# Altium project eva01.PrjPcb (part 2 of 2)

## Sheet wifi.schdoc: DevelBoard EVA01 WiFi Module.
size A3; Author: Daniele Basile <asterix@develer.com>; Organization: Develer s.r.l.; Address1: via Mugellese 1/A; Address2: 50019 Campi Bisenzio; Address3: Firenze; Address4: ITALY; DocumentNumber: 6; Revision: B; SheetNumber: 6; SheetTotal: 6; Hw_rev: R2
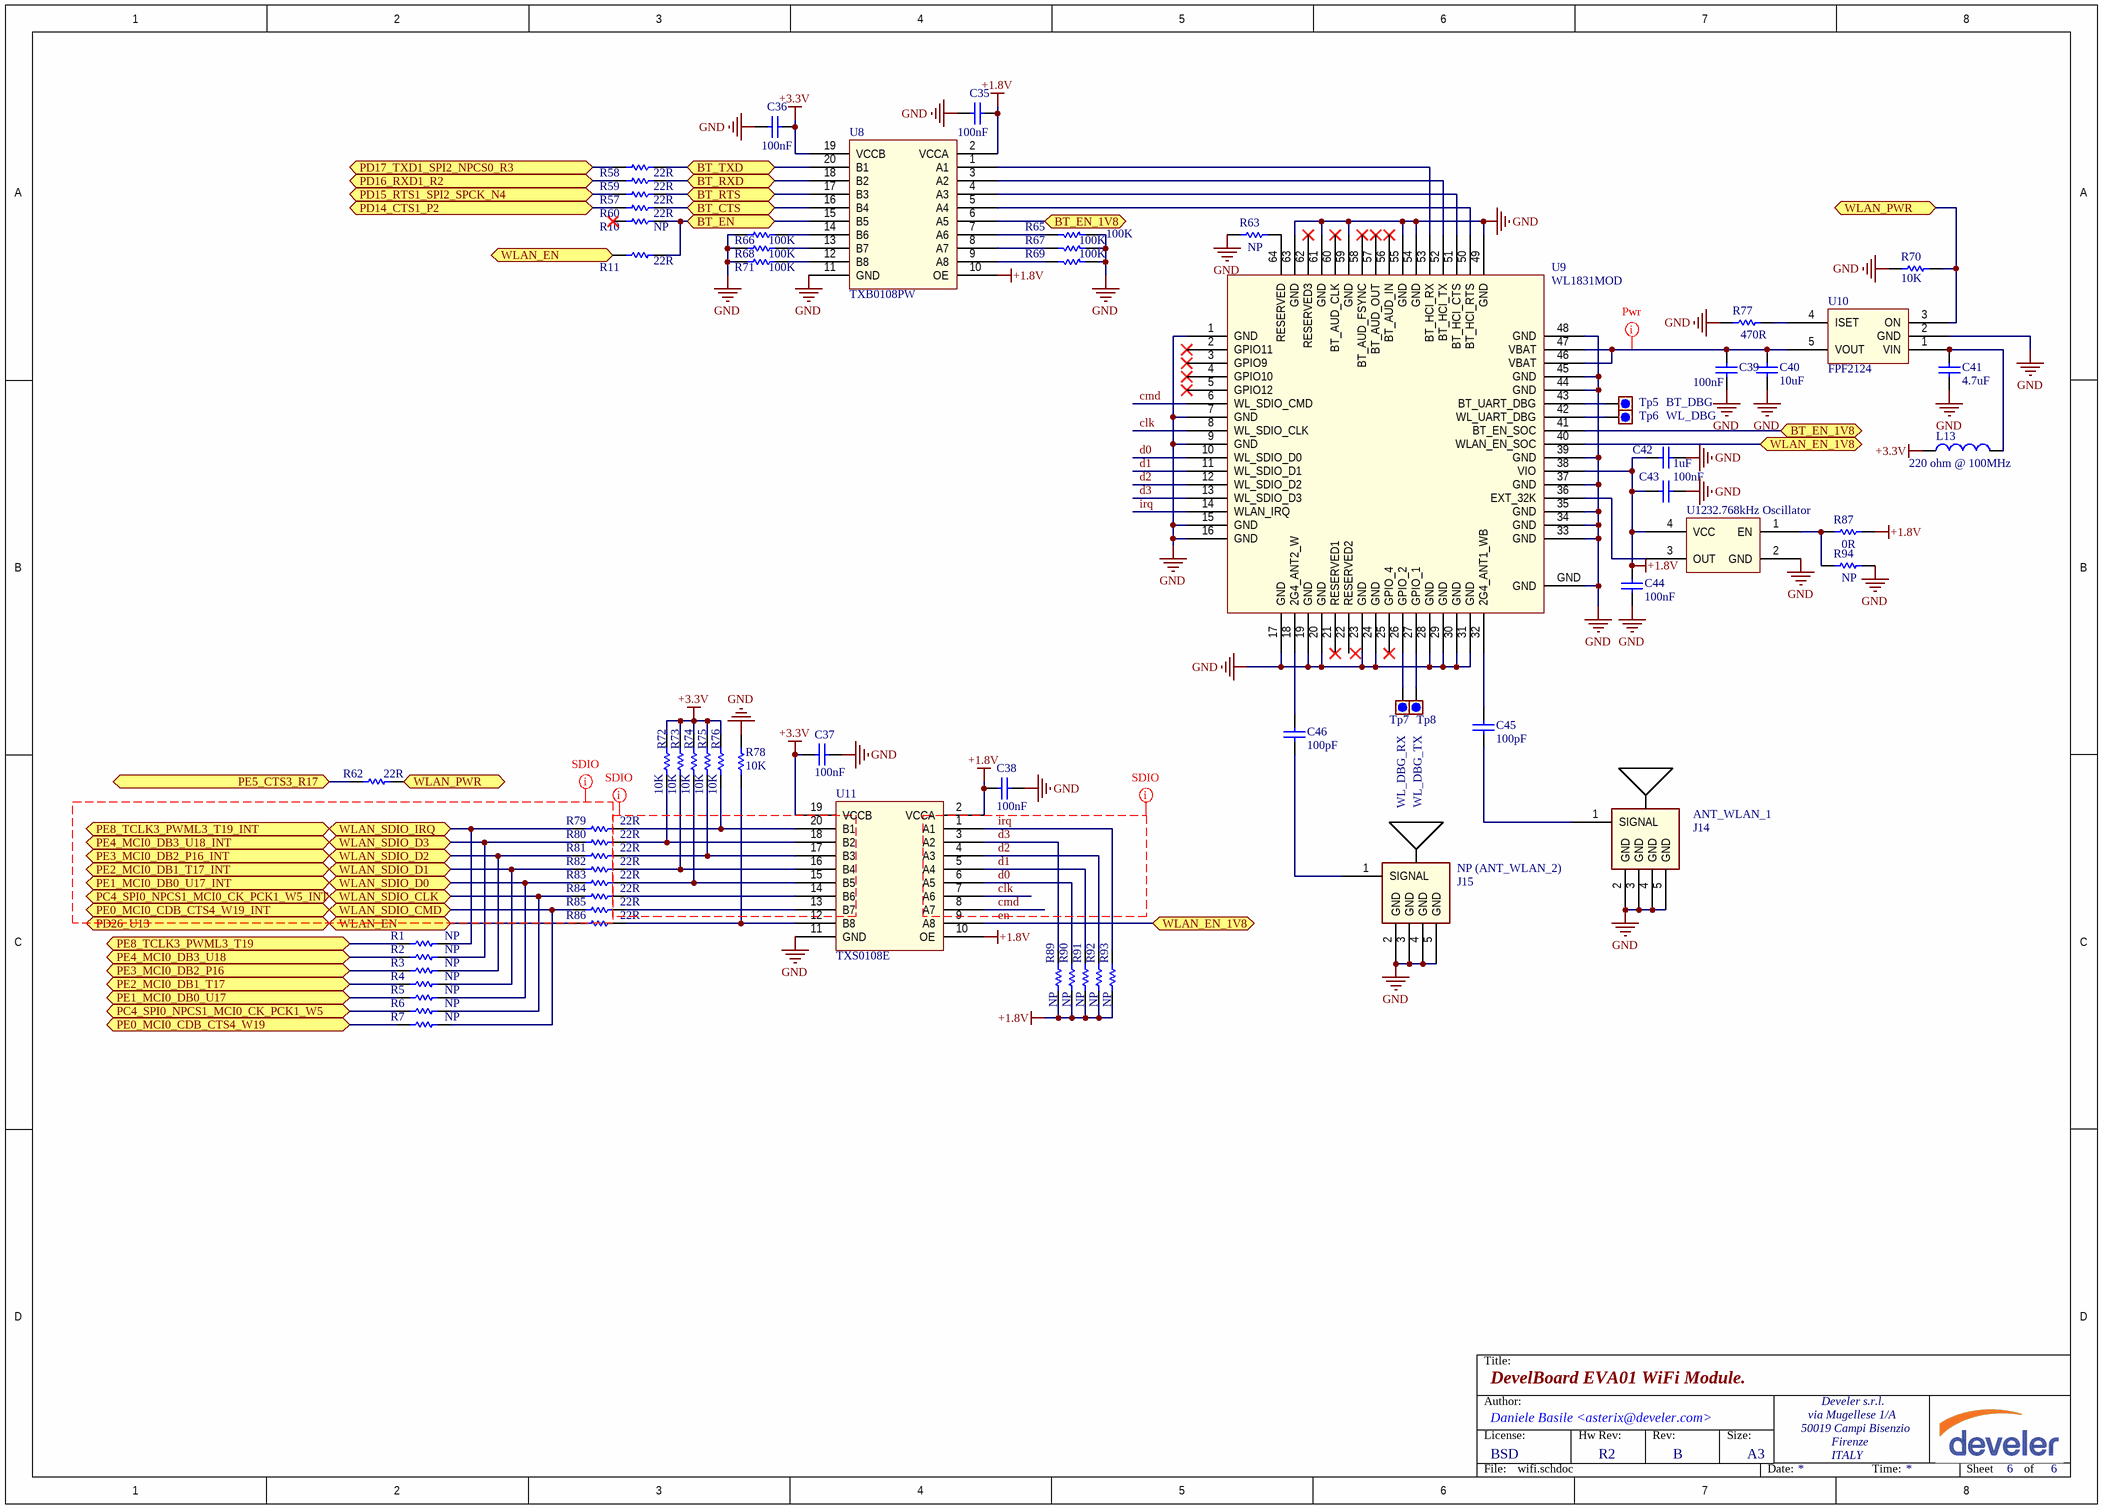
[diagram p5: wifi.schdoc]

### Parts
C35  100nF  [0603_[1608]]
C36  100nF  [0603_[1608]]
C37  100nF  [0603_[1608]]
C38  100nF  [0603_[1608]]
C39  100nF  [0603_[1608]]
C40  10uF  [1206_[3216]]
C41  4.7uF  [0805_[2012]]
C42  1uF  [1206_[3216]]
C43  100nF  [0603_[1608]]
C44  100nF  [0603_[1608]]
C45  100pF  [0603_[1608]]
C46  100pF  [0603_[1608]]
J14  ANT_WLAN_1  [SMA_Jack_Female_5.08mm_THD]
J15  NP (ANT_WLAN_2)  [SMA_Jack_Female_5.08mm_THD]
L13  220 ohm @ 100MHz  [0805_[2012]]
R1  NP  [0603_[1608]]
R2  NP  [0603_[1608]]
R3  NP  [0603_[1608]]
R4  NP  [0603_[1608]]
R5  NP  [0603_[1608]]
R6  NP  [0603_[1608]]
R7  NP  [0603_[1608]]
R10  NP  [0603_[1608]]
R11  22R  [0603_[1608]]
R57  22R  [0603_[1608]]
R58  22R  [0603_[1608]]
R59  22R  [0603_[1608]]
R60  22R  [0603_[1608]]
R62  22R  [0603_[1608]]
R63  NP  [0603_[1608]]
R65  100K  [0603_[1608]]
R66  100K  [0603_[1608]]
R67  100K  [0603_[1608]]
R68  100K  [0603_[1608]]
R69  100K  [0603_[1608]]
R70  10K  [0603_[1608]]
R71  100K  [0603_[1608]]
R72  10K  [0603_[1608]]
R73  10K  [0603_[1608]]
R74  10K  [0603_[1608]]
R75  10K  [0603_[1608]]
R76  10K  [0603_[1608]]
R77  470R  [0603_[1608]]
R78  10K  [0603_[1608]]
R79  22R  [0603_[1608]]
R80  22R  [0603_[1608]]
R81  22R  [0603_[1608]]
R82  22R  [0603_[1608]]
R83  22R  [0603_[1608]]
R84  22R  [0603_[1608]]
R85  22R  [0603_[1608]]
R86  22R  [0603_[1608]]
R87  0R  [0603_[1608]]
R89  NP  [0603_[1608]]
R90  NP  [0603_[1608]]
R91  NP  [0603_[1608]]
R92  NP  [0603_[1608]]
R93  NP  [0603_[1608]]
R94  NP  [0603_[1608]]
Tp5  BT_DBG  [TEST_POINT_SMD_D1MM]  (no BOM)
Tp6  WL_DBG  [TEST_POINT_SMD_D1MM]  (no BOM)
Tp7  WL_DBG_RX  [TEST_POINT_SMD_D1MM]  (no BOM)
Tp8  WL_DBG_TX  [TEST_POINT_SMD_D1MM]  (no BOM)
U8  TXB0108PW  [TSOP65P640X120-20L]
U9  WL1831MOD  [WL18XX_E-13.4X13.3-N100_0.75]
U10  FPF2124  [SOT-23-5]
U11  TXS0108E  [TSOP65P640X120-20L]
U12  32.768kHz Oscillator  [CRYSTAL_3.2X1.5MM_4P_SMD]

### Ports
BT_CTS, BT_EN, BT_EN_1V8, BT_RTS, BT_RXD, BT_TXD, PC4_SPI0_NPCS1_MCI0_CK_PCK1_W5, PC4_SPI0_NPCS1_MCI0_CK_PCK1_W5_INT, PD14_CTS1_P2, PD15_RTS1_SPI2_SPCK_N4, PD16_RXD1_R2, PD17_TXD1_SPI2_NPCS0_R3, PD26_U13, PE0_MCI0_CDB_CTS4_W19, PE0_MCI0_CDB_CTS4_W19_INT, PE1_MCI0_DB0_U17, PE1_MCI0_DB0_U17_INT, PE2_MCI0_DB1_T17, PE2_MCI0_DB1_T17_INT, PE3_MCI0_DB2_P16, PE3_MCI0_DB2_P16_INT, PE4_MCI0_DB3_U18, PE4_MCI0_DB3_U18_INT, PE5_CTS3_R17, PE8_TCLK3_PWML3_T19, PE8_TCLK3_PWML3_T19_INT, WLAN_EN, WLAN_EN_1V8, WLAN_PWR, WLAN_SDIO_CLK, WLAN_SDIO_CMD, WLAN_SDIO_D0, WLAN_SDIO_D1, WLAN_SDIO_D2, WLAN_SDIO_D3, WLAN_SDIO_IRQ

### Nets
+1.8V: C35.2 C38.2 C42.2 C43.2 C44.2 R87.1 R89.1 R90.1 R91.1 R92.1 R93.1 U8.2(VCCA) U8.10(OE) U9.38(VIO) U11.2(VCCA) U11.10(OE) U12.4(VCC)
+3.3V: C36.2 C37.2 L13.2 R72.1 R73.1 R74.1 R75.1 R76.1 U8.19(VCCB) U11.19(VCCB)
GND: C35.1 C36.1 C37.1 C38.1 C39.1 C40.1 C41.1 C42.1 C43.1 C44.1 J14.2(GND) J14.3(GND) J14.4(GND) J14.5(GND) J15.2(GND) J15.3(GND) J15.4(GND) J15.5(GND) R63.2 R65.2 R66.2 R67.2 R68.2 R69.2 R70.1 R71.2 R77.2 R78.1 R94.1 U8.11(GND) U9.1(GND) U9.7(GND) U9.9(GND) U9.15(GND) U9.16(GND) U9.17(GND) U9.19(GND) U9.20(GND) U9.23(GND) U9.24(GND) U9.28(GND) U9.29(GND) U9.30(GND) U9.31(GND) U9.33(GND) U9.34(GND) U9.35(GND) U9.37(GND) U9.39(GND) U9.44(GND) U9.45(GND) U9.48(GND) U9.49(GND) U9.54(GND) U9.55(GND) U9.59(GND) U9.61(GND) U9.63(GND) U9.GND U10.2(GND) U11.11(GND) U12.2(GND)
BT_CTS: R60.2 U8.16(B4) ; port BT_CTS
BT_EN: R10.2 R11.2 U8.15(B5) ; port BT_EN
BT_EN_1V8: U8.6(A5) U9.41(BT_EN_SOC) ; port BT_EN_1V8
BT_RTS: R57.2 U8.17(B3) ; port BT_RTS
BT_RXD: R59.2 U8.18(B2) ; port BT_RXD
BT_TXD: R58.2 U8.20(B1) ; port BT_TXD
clk: U9.8(WL_SDIO_CLK) U11.7(A6)
cmd: U9.6(WL_SDIO_CMD) U11.8(A7)
d0: R90.2 U9.10(WL_SDIO_D0) U11.6(A5)
d1: R91.2 U9.11(WL_SDIO_D1) U11.5(A4)
d2: R92.2 U9.12(WL_SDIO_D2) U11.4(A3)
d3: R89.2 U9.13(WL_SDIO_D3) U11.3(A2)
en: U9.40(WLAN_EN_SOC) U11.9(A8) ; port WLAN_EN_1V8
irq: R93.2 U9.14(WLAN_IRQ) U11.1(A1)
PC4_SPI0_NPCS1_MCI0_CK_PCK1_W5: R6.2 ; port PC4_SPI0_NPCS1_MCI0_CK_PCK1_W5
PC4_SPI0_NPCS1_MCI0_CK_PCK1_W5_INT: R6.1 R84.2 ; port WLAN_SDIO_CLK, port PC4_SPI0_NPCS1_MCI0_CK_PCK1_W5_INT
PD14_CTS1_P2: R60.1 ; port PD14_CTS1_P2
PD15_RTS1_SPI2_SPCK_N4: R57.1 ; port PD15_RTS1_SPI2_SPCK_N4
PD16_RXD1_R2: R59.1 ; port PD16_RXD1_R2
PD17_TXD1_SPI2_NPCS0_R3: R58.1 ; port PD17_TXD1_SPI2_NPCS0_R3
PD26_U13: R11.1 R86.2 ; port WLAN_EN, port PD26_U13
PE0_MCI0_CDB_CTS4_W19: R7.2 ; port PE0_MCI0_CDB_CTS4_W19
PE0_MCI0_CDB_CTS4_W19_INT: R7.1 R85.2 ; port WLAN_SDIO_CMD, port PE0_MCI0_CDB_CTS4_W19_INT
PE1_MCI0_DB0_U17: R5.2 ; port PE1_MCI0_DB0_U17
PE1_MCI0_DB0_U17_INT: R5.1 R83.2 ; port WLAN_SDIO_D0, port PE1_MCI0_DB0_U17_INT
PE2_MCI0_DB1_T17: R4.2 ; port PE2_MCI0_DB1_T17
PE2_MCI0_DB1_T17_INT: R4.1 R82.2 ; port WLAN_SDIO_D1, port PE2_MCI0_DB1_T17_INT
PE3_MCI0_DB2_P16: R3.2 ; port PE3_MCI0_DB2_P16
PE3_MCI0_DB2_P16_INT: R3.1 R81.2 ; port WLAN_SDIO_D2, port PE3_MCI0_DB2_P16_INT
PE4_MCI0_DB3_U18: R2.2 ; port PE4_MCI0_DB3_U18
PE4_MCI0_DB3_U18_INT: R2.1 R80.2 ; port WLAN_SDIO_D3, port PE4_MCI0_DB3_U18_INT
PE5_CTS3_R17: R62.1 ; port PE5_CTS3_R17
PE8_TCLK3_PWML3_T19: R1.2 ; port PE8_TCLK3_PWML3_T19
PE8_TCLK3_PWML3_T19_INT: R1.1 R79.2 ; port WLAN_SDIO_IRQ, port PE8_TCLK3_PWML3_T19_INT
WLAN_PWR: R62.2 R70.2 U10.3(ON) ; port WLAN_PWR
NetC39_2: C39.2 C40.2 U9.46(VBAT) U9.47(VBAT) U10.5(VOUT)
NetC41_2: C41.2 L13.1 U10.1(VIN)
NetC45_1: C45.1 U9.32(2G4_ANT1_WB)
NetC45_2: C45.2 J14.1(SIGNAL)
NetC46_1: C46.1 U9.18(2G4_ANT2_W)
NetC46_2: C46.2 J15.1(SIGNAL)
NetR63_1: R63.1 U9.64(RESERVED)
NetR65_1: R65.1 U8.7(A6)
NetR66_1: R66.1 U8.14(B6)
NetR67_1: R67.1 U8.8(A7)
NetR68_1: R68.1 U8.13(B7)
NetR69_1: R69.1 U8.9(A8)
NetR71_1: R71.1 U8.12(B8)
NetR72_2: R72.2 R80.1 U11.18(B2)
NetR73_2: R73.2 R82.1 U11.16(B4)
NetR74_2: R74.2 R83.1 U11.15(B5)
NetR75_2: R75.2 R81.1 U11.17(B3)
NetR76_2: R76.2 R79.1 U11.20(B1)
NetR77_1: R77.1 U10.4(ISET)
NetR78_2: R78.2 R86.1 U11.12(B8)
NetR84_1: R84.1 U11.14(B6)
NetR85_1: R85.1 U11.13(B7)
NetR87_2: R87.2 R94.2 U12.1(EN)
NetTp5_1: Tp5.1 U9.43(BT_UART_DBG)
NetTp6_1: Tp6.1 U9.42(WL_UART_DBG)
NetTp7_1: Tp7.1 U9.26(GPIO_2)
NetTp8_1: Tp8.1 U9.27(GPIO_1)
NetU8_1: U8.1(A1) U9.53(BT_HCI_RX)
NetU8_3: U8.3(A2) U9.52(BT_HCI_TX)
NetU8_4: U8.4(A3) U9.51(BT_HCI_CTS)
NetU8_5: U8.5(A4) U9.50(BT_HCI_RTS)
NetU9_36: U9.36(EXT_32K) U12.3(OUT)

Not connected (* = marked no-connect by the designer): R10 1*; U9 2(GPIO11)* 3(GPIO9)* 4(GPIO10)* 5(GPIO12)* 21(RESERVED1)* 22(RESERVED2) 25(GPIO_4)* 56(BT_AUD_IN)* 57(BT_AUD_OUT)* 58(BT_AUD_FSYNC)* 60(BT_AUD_CLK)* 62(RESERVED3)*

### Layout directives
net class Power: NetC39_2
net class SDIO_BUS: (no net found under the mark)
net class SDIO: (no net found under the mark)
net class SDIO_LOWBUS: clk, cmd, d0, d1, d2, d3, irq

### Notes on the sheet
- Title:
- Author:
- License:
- BSD
- Hw Rev:
- Rev:
- Size:
- A3
- File:
- Date:
- Time:
- Sheet
- of

### Library data of the parts
C35-C39 C42-C44 = Cap: Ceramic X7R 50V; Value: 10nF; Published: 8-Jun-2000; Revision: July-2002: Re-released for DXP Platform.; Publisher: Altium Limited
C40 = Cap: Ceramic X5R 25V; Value: 10nF; Published: 8-Jun-2000; Revision: July-2002: Re-released for DXP Platform.; Publisher: Altium Limited
C41 = Cap: Ceramic X7R 10V; Value: 10nF; Published: 8-Jun-2000; Revision: July-2002: Re-released for DXP Platform.; Publisher: Altium Limited
C45 C46 = Cap: Ceramic COG 50V; Value: 10nF; Published: 8-Jun-2000; Revision: July-2002: Re-released for DXP Platform.; Publisher: Altium Limited
J14 J15 = ANTENNA: SMA, Jack, Right angle, PCB socket, 50ohm (TE 5-1814400-1)
L13 = Inductor: Ferrite Beat (WE 742792022)
R1-R7 R10 R11 R57-R60 R62 R63 R65-R87 R89-R94 = Res1: Resistor; Value: 1K; Published: 8-Jun-2000; Revision: July-2002: Re-released for DXP Platform.; Publisher: Altium Limited
Tp5-Tp8 = Test_point: Test point
U8 U11 = TXB0108PW: 8-bit bidirectional level translator
U9 = WL1831MOD: Wifi & Bluethoot module
U10 = FPF2124: Power Load Switch
U12 = Si501/2/3_32768Hz: 32.768kHz Oscillator (EPSON  X1B0002110001 SG-3030CM)

## Nets that join several sheets
+1.8V: connectors (J1.4 J16.50), supply (D17.1 L16.1 Tp4.1), wifi (17 pins)
+3.3V: connectors (J1.2 J16.3), develboard (L1.1), sd_debug (C23.1 J10.4 L7.1), supply (D5.1 L12.1 L15.1 Tp9.1), usb_ethernet (5 pins), wifi (10 pins)
+5V: connectors (J1.3 J7.3 J7.50 J16.1), sd_debug (J4.2), supply (D4.1 D6.1 L5.1 Tp10.1), usb_ethernet (C28.1 U5.7)
+24V: connectors (J1.1 J7.52), supply (9 pins)
GND: connectors (14 pins), develboard (11 pins), sd_debug (21 pins), supply (34 pins), usb_ethernet (16 pins), wifi (62 pins)
SHLD: sd_debug (9 pins), usb_ethernet (9 pins)
VBatt: connectors (J7.1), develboard (U1.126), supply (5 pins)
VCC_USB: sd_debug (6 pins), supply (D8.1 Tp16.1)
ADCREF_EXT: connectors (J7.45), develboard (U1.150)
BOOT_RECOVERY: connectors (J7.51), develboard (U1.152)
ETH_LEDACTLINK: develboard (U1.77), usb_ethernet (J13.12)
ETH_LEDSPEED: develboard (U1.76), usb_ethernet (J13.10)
ETHRX_N: develboard (U1.78), usb_ethernet (J13.6)
ETHRX_P: develboard (U1.79), usb_ethernet (J13.3)
ETHTX_N: develboard (U1.80), usb_ethernet (J13.2)
ETHTX_P: develboard (U1.81), usb_ethernet (J13.1)
JTAGSEL_V2: connectors (J7.36), develboard (U1.131)
PA0_LCDDAT0_TMS_A7: connectors (J1.42), develboard (U1.61)
PA1_LCDDAT1_F6: connectors (J1.41), develboard (U1.51)
PA2_LCDDAT2_G1_TXCK_E6: connectors (J1.40), develboard (U1.53)
PA3_LCDDAT3_G1_RXCK_C6: connectors (J1.39), develboard (U1.57)
PA4_LCDDAT4_G1_TXEN_D6: connectors (J1.38), develboard (U1.55)
PA5_LCDDAT5_G1_TXER_B6: connectors (J1.37), develboard (U1.59)
PA6_LCDDAT6_G1_CRS_A6: connectors (J1.36), develboard (U1.62)
PA7_LCDDAT7_E5: connectors (J1.35), develboard (U1.50)
PA8_LCDDAT8_TCK_A5: connectors (J1.32), develboard (U1.65)
PA9_LCDDAT9_G1_COL_F4: connectors (J1.31), develboard (U1.72)
PA10_LCDDAT10_G1_RXDV_F5: connectors (J1.30), develboard (U1.49)
PA11_LCDDAT11_G1_RXER_D5: connectors (J1.29), develboard (U1.54)
PA12_LCDDAT12_G1_RX0_G5: connectors (J1.28), develboard (U1.47)
PA13_LCDDAT13_G1_RX1_C5: connectors (J1.27), develboard (U1.58)
PA14_LCDDAT14_G1_TX0_E4: connectors (J1.26), develboard (U1.52)
PA15_LCDDAT15_G1_TX1_B5: connectors (J1.25), develboard (U1.60)
PA16_LCDDAT16_NTRST_H6: connectors (J1.22), develboard (U1.48)
PA17_LCDDAT17_D4: connectors (J1.21), develboard (U1.71)
PA18_LCDDAT18_G1_RX2_G4: connectors (J1.20), develboard (U1.75)
PA19_LCDDAT19_G1_RX3_C4: connectors (J1.19), develboard (U1.68)
PA20_LCDDAT20_G1_TX2_A3: connectors (J1.18), develboard (U1.69)
PA21_LCDDAT21_G1_TX3_B4: connectors (J1.17), develboard (U1.66)
PA22_LCDDAT22_G1_MDC_B3: connectors (J1.16), develboard (U1.70)
PA23_LCDDAT23_G1_MDIO_A4: connectors (J1.15), develboard (U1.67)
PA24_LCDPWM_PCK0_H5: connectors (J1.10), develboard (U1.45)
PA25_LCDDISP_TD0_F3: connectors (J1.12), develboard (U1.73)
PA26_LCDVSYNC_PWMH0_SP1_NPCS1_E3: connectors (J1.9), develboard (U1.56)
PA27_LCDHSYNC_PWML0_SPI1_NPCS2_H4: connectors (J1.7), develboard (U1.44)
PA28_LCDPCK_PWMH1_SP1_NPCS3_G3: connectors (J1.11), develboard (U1.74)
PA29_LCDDEN_PWML1_J5: connectors (J1.8), develboard (U1.46)
PA30_TWD0_D3: connectors (J7.48), develboard (U1.140)
PA31_TWCK0_J4: connectors (J7.46), develboard (U1.139)
PB1_G0_RXCK_SCK2_ISI_PCK_A2: connectors (J7.4), develboard (U1.93)
PB3_G0_TXER_CTS2_ISI_VSYNC_C2: connectors (J7.5), develboard (U1.94)
PB4_G0_CRS_RXD2_ISI_HSYNC_J3: connectors (J7.13), develboard (U1.107)
PB5_G0_COL_TXD2_PCK2_H2: connectors (J7.11), develboard (U1.102)
PB10_G0_RX2_PCK2_PWML1_F1: connectors (J7.9), develboard (U1.100)
PB11_G0_RX3_RTS2_PWMH1_K4: connectors (J7.14), develboard (U1.108)
PB14_G0_TX2_SPI2_NPCS1_PWMH0_A1: connectors (J7.6), develboard (U1.97)
PB15_G0_TX3_SPI2_NPCS2_PWML0_E2: connectors (J7.8), develboard (U1.99)
PB18_SPI1_MISO_K2: connectors (J1.46), develboard (U1.110)
PB19_SPI1_MOSI_C1: connectors (J1.48), develboard (U1.95)
PB20_SPI1_SPCK__D1: connectors (J1.50), develboard (U1.96)
PB21_SPI1_NPCS0_L3: connectors (J7.16), develboard (U1.111)
PB22_SPI1_NPCS1_G1: connectors (J7.10), develboard (U1.101)
PB23_SPI1_NPCS2_H1: connectors (J1.52), develboard (U1.103)
PB24_DRXD_TDI_E1: connectors (J7.7), develboard (U1.98)
PB25_DTXD_TDO_J1: connectors (J7.12), develboard (U1.104)
PB26_PCK0_RK0_PWMH0_M5: connectors (J16.46), develboard (U1.157)
PB27_SPI1_NPCS3_TK0_PWML0_L2: connectors (J7.18), develboard (U1.113)
PB28_SPI2_NPCS3_TD0_PWMH1_K1: connectors (J7.15), develboard (U1.109)
PB29_TWD2_RD0_PWML1_M3: connectors (J7.41), develboard (U1.137)
PB30_TWCK2_RF0_M4: connectors (J7.33), develboard (U1.129)
PB31_TF0_L1: connectors (J7.17), develboard (U1.112)
PC0_SPI0_MISO_PWMH2_ISI_D8: connectors (J7.49), develboard (U1.153)
PC1_SPI0_MOSI_PWML2_ISI_D9_P8: connectors (J16.44), develboard (U1.159)
PC2_SPI0_SPCK_PWMH3_ISI_D10_V5: connectors (J7.47), develboard (U1.151)
PC3_SPI0_NPCS0_PWML3_ISI_D11_T9: connectors (J16.39), develboard (U1.2)
PC4_SPI0_NPCS1_MCI0_CK_PCK1_W5: connectors (J16.34), wifi (R6.2)
PC4_SPI0_NPCS1_MCI0_CK_PCK1_W5_INT: develboard (U1.138), wifi (R6.1 R84.2)
PC19_ISI_D0_TK1_U14: connectors (J16.31), develboard (U1.7)
PC20_ISI_D1_TF1_V11: connectors (J16.35), develboard (U1.3)
PC21_ISI_D2_TD1_U15: connectors (J16.28), develboard (U1.8)
PC22_ISI_D3_RF1_T15: connectors (J16.42), develboard (U1.161)
PC23_ISI_D4_RD1_U16: connectors (J16.27), develboard (U1.10)
PC24_ISI_D5_RK1_PCK1_T16: connectors (J16.29), develboard (U1.9)
PC25_ISI_D6_TWD3_URXD1_V17: connectors (J16.15), develboard (U1.25)
PC26_ISI_D7_TWCK3_UTXD1_R16: connectors (J16.26), develboard (U1.11)
PC27_AD0_SPI0_NPCS1_PWML0_U12: connectors (J1.45), develboard (U1.136)
PC28_AD1_SPI0_NPCS2_PWML1_T11: connectors (J1.47), develboard (U1.134)
PC29_AD2_SPI0_NPCS3_PWMFI0_R13: connectors (J1.49), develboard (U1.16)
PC30_AD3_PWMH0_T12: connectors (J1.51), develboard (U1.1)
PC31_AD4_PWMH1_T13: connectors (J16.32), develboard (U1.6)
PD8_PCK0_M1: connectors (J7.19), develboard (U1.114)
PD9_FIQ_M2: connectors (J7.20), develboard (U1.115)
PD10_CTS0_N2: connectors (J7.24), develboard (U1.118)
PD11_RTS0_SPI2_MISO_N3: connectors (J7.23), develboard (U1.119)
PD12_RXD0_N1: connectors (J7.21), develboard (U1.117)
PD13_TXD0_SPI2_MOSI_P3: connectors (J7.26), develboard (U1.120)
PD14_CTS1_P2: connectors (J7.34), develboard (U1.130), wifi (R60.1)
PD15_RTS1_SPI2_SPCK_N4: connectors (J16.48), develboard (U1.155), wifi (R57.1)
PD16_RXD1_R2: connectors (J7.31), develboard (U1.127), wifi (R59.1)
PD17_TXD1_SPI2_NPCS0_R3: connectors (J7.32), develboard (U1.128), wifi (R58.1)
PD19_P11: connectors (J16.36), develboard (U1.168)
PD20_T10: connectors (J16.47), develboard (U1.158)
PD21_P10: connectors (J16.40), develboard (U1.165)
PD22_U11: connectors (J16.37), develboard (U1.4)
PD23_R10: connectors (J16.41), develboard (U1.166)
PD24_U10: connectors (J16.38), develboard (U1.167)
PD25_R11: connectors (J16.33), develboard (U1.5)
PD26_U13: connectors (J7.37), develboard (U1.133), wifi (R11.1 R86.2)
PD27_T14: connectors (J16.45), develboard (U1.160)
PD28_SCK0_R1: connectors (J7.28), develboard (U1.122)
PD29_SCK1_P1: connectors (J7.25), develboard (U1.121)
PD31_SPI0_NPCS2_PCK1_P5: connectors (J16.49), develboard (U1.156)
PE0_MCI0_CDB_CTS4_W19: connectors (J16.30), wifi (R7.2)
PE0_MCI0_CDB_CTS4_W19_INT: develboard (U1.28), wifi (R7.1 R85.2)
PE1_MCI0_DB0_U17: connectors (J16.19), wifi (R5.2)
PE1_MCI0_DB0_U17_INT: develboard (U1.23), wifi (R5.1 R83.2)
PE2_MCI0_DB1_T17: connectors (J16.20), wifi (R4.2)
PE2_MCI0_DB1_T17_INT: develboard (U1.26), wifi (R4.1 R82.2)
PE3_MCI0_DB2_P16: connectors (J16.21), wifi (R3.2)
PE3_MCI0_DB2_P16_INT: develboard (U1.12), wifi (R3.1 R81.2)
PE4_MCI0_DB3_U18: connectors (J16.22), wifi (R2.2)
PE4_MCI0_DB3_U18_INT: develboard (U1.19), wifi (R2.1 R80.2)
PE5_CTS3_R17: connectors (J16.17), develboard (U1.20), wifi (R62.1)
PE6_TIOA3_V19: connectors (J16.14), develboard (U1.30)
PE7_TIOB3_PWMFI1_U19: connectors (J16.11), develboard (U1.31)
PE8_TCLK3_PWML3_T19: connectors (J16.23), wifi (R1.2)
PE8_TCLK3_PWML3_T19_INT: develboard (U1.24), wifi (R1.1 R79.2)
PE9_TIOA2_T18: connectors (J16.12), develboard (U1.32)
PE10_TIOB2_N14: connectors (J16.43), develboard (U1.164)
PE11_TCLK2_R18: connectors (J16.8), develboard (U1.36), usb_ethernet (R51.1)
PE12_TIOA1_PWMH2_P17: connectors (J16.16), develboard (U1.27), usb_ethernet (R52.1)
PE13_TIOB1_PWML2_P18: connectors (J16.10), develboard (U1.34)
PE14_TCLK1_PWMH3_N17: connectors (J16.13), develboard (U1.29), usb_ethernet (R54.1)
PE15_SCK3_TIOA0_N18: connectors (J16.5), develboard (U1.39)
PE16_RXD3_TIOB0_M15: connectors (J16.25), develboard (U1.14), sd_debug (R37.1)
PE17_TXD3_TCLK0_N19: connectors (J16.6), develboard (U1.38), sd_debug (R38.1)
PE18_TIOA5_MCI1_CK_P19: develboard (U1.35), sd_debug (R46.1)
PE19_TIOB5_MCI1_CDA_N16: develboard (U1.18), sd_debug (R47.1)
PE20_TCLK5_MCI1_DA0_M14: develboard (U1.13), sd_debug (R45.1)
PE21_TIOA4_MCI1_DA1_M18: develboard (U1.41), sd_debug (R44.1)
PE22_TIOB4_MCI1_DA2_M19: develboard (U1.40), sd_debug (R49.1)
PE23_TCLK4_MCI_DA3_L18: develboard (U1.43), sd_debug (R48.1)
PE24_RTS3_L19: connectors (J16.9), develboard (U1.33)
PE25_SCK4_IRQ_M17: connectors (J16.7), develboard (U1.37)
PE26_RXD4_L15: connectors (J16.24), develboard (U1.15)
PE27_TXD4_M16: connectors (J16.18), develboard (U1.17)
PE28_RTS4_L17: connectors (J16.4), develboard (U1.42)
PE29_DIBP_URXD0_TWD1_V1: connectors (J7.27), develboard (U1.123)
PE30_DIBN_UTXD0_TWCK1_U2: connectors (J7.29), develboard (U1.125)
PE31_ADTRG_L4: connectors (J7.22), develboard (U1.116)
PIOBU0_U3: connectors (J7.39), develboard (U1.135)
PIOBU1: connectors (J16.51), develboard (U1.154)
RESET: connectors (J1.6 J7.43), develboard (U1.149), sd_debug (R33.2)
SHDN_T2: connectors (J7.30), develboard (U1.124)
usb1_n: develboard (U1.143), usb_ethernet (L11.1)
usb1_p: develboard (U1.144), usb_ethernet (L11.4)
usb2_n: develboard (U1.146), usb_ethernet (L10.1)
usb2_p: develboard (U1.145), usb_ethernet (L10.4)
usb_otg_n: connectors (J7.42), develboard (U1.141)
usb_otg_p: connectors (J7.40), develboard (U1.142)
WKUP_V3: connectors (J7.35), develboard (U1.132)